# EAGLE design BatteryTestBoard V1 (EAGLE 8.2.2)
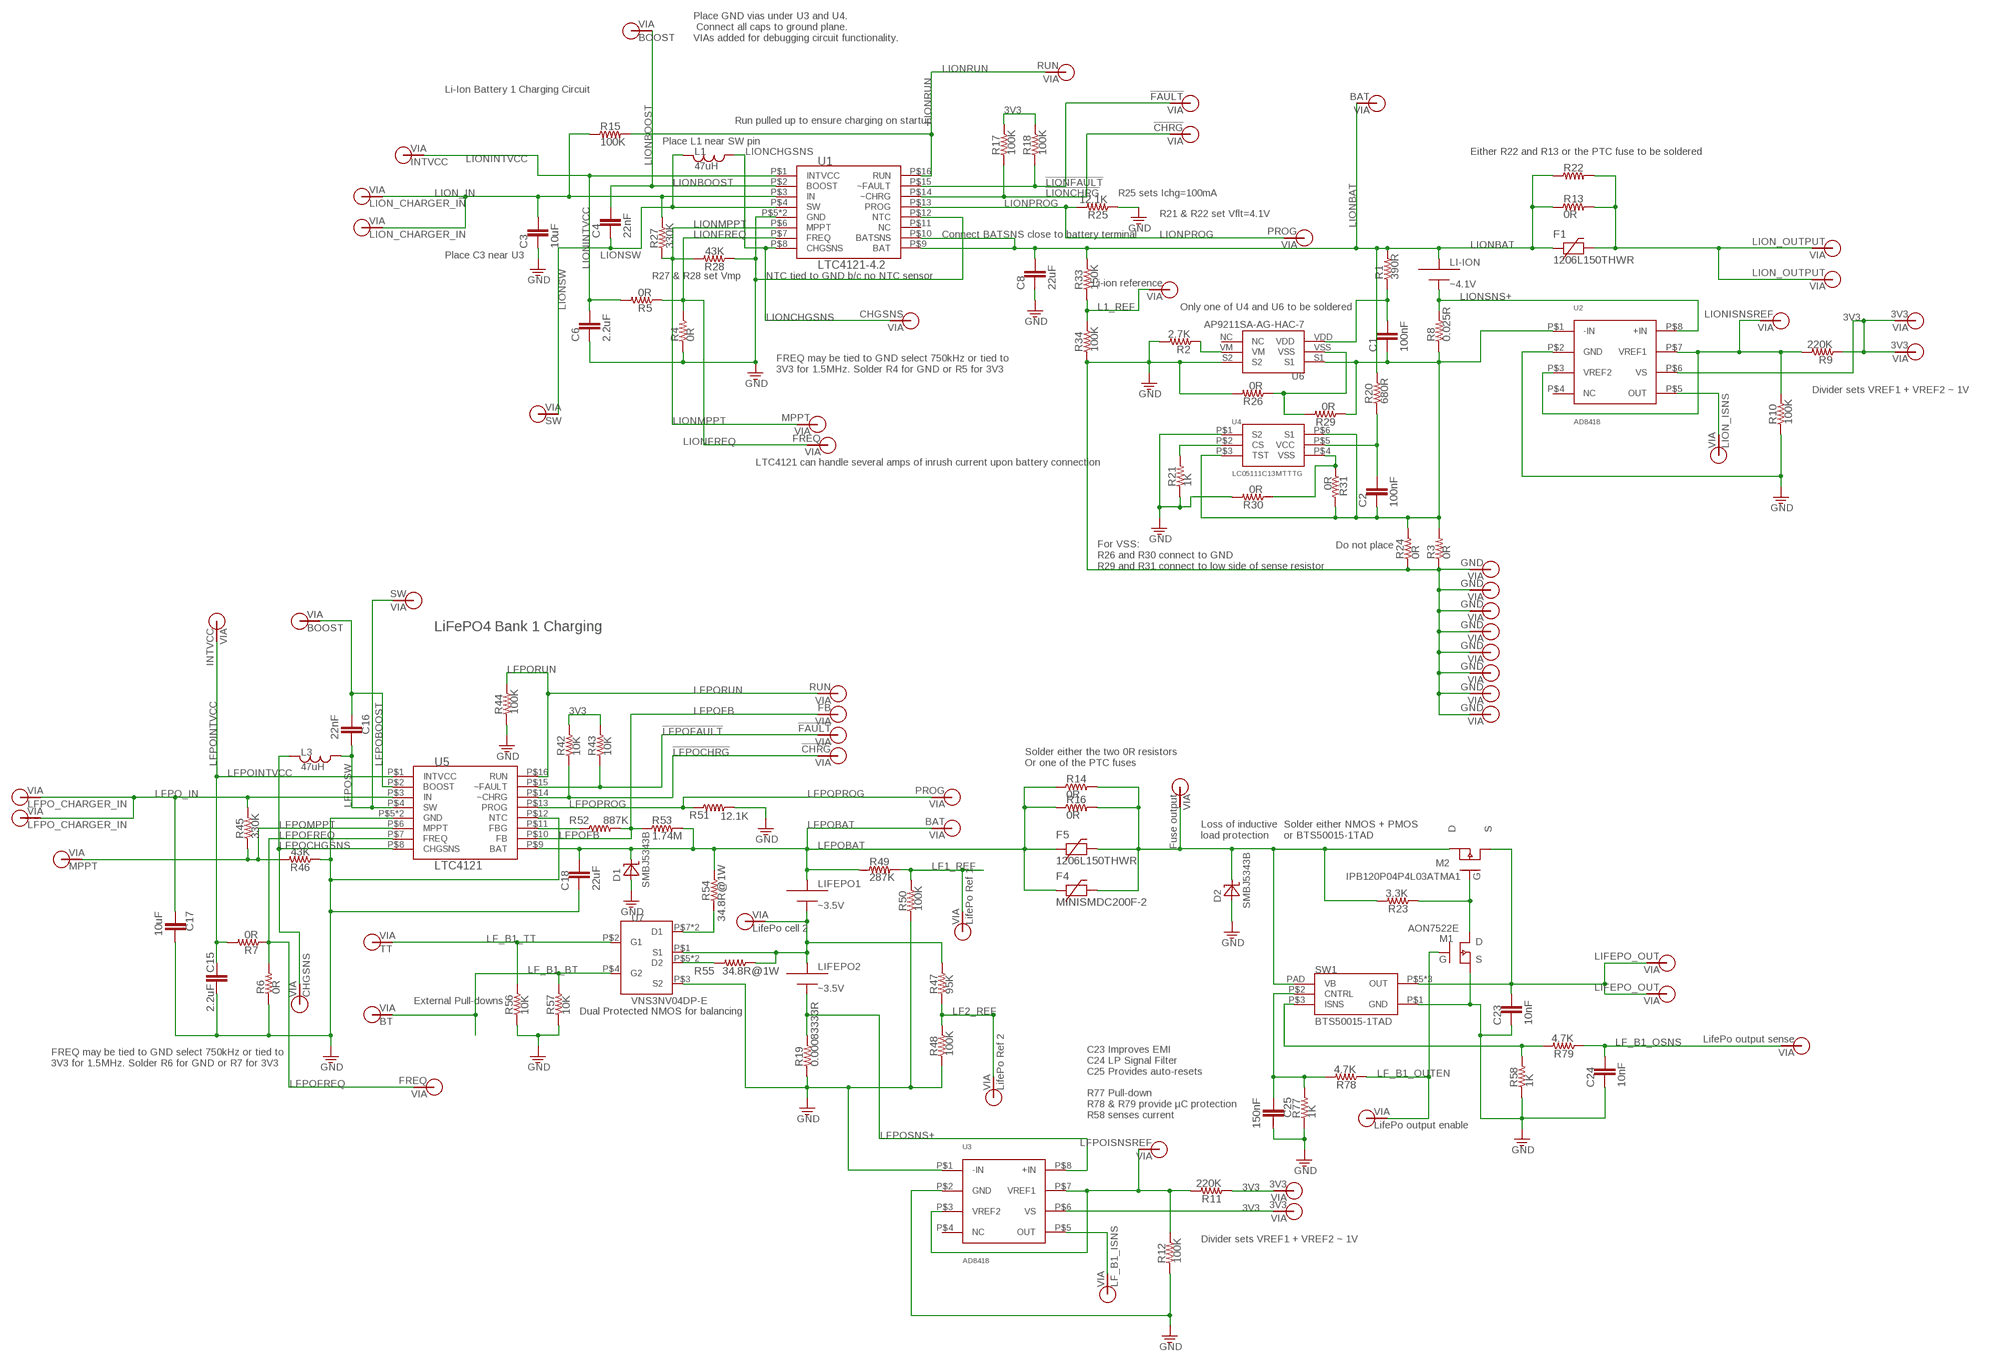
[diagram p0: schematic, sheet 1]

## Parts
C1  100nF  CAP0805  [0805]
C2  100nF  CAP0805  [0805]
C3  10uF  CAP0805  [0805]
C4  22nF  CAP0805  [0805]
C6  2.2uF  CAP0805  [0805]
C8  22uF  CAP0805  [0805]
C15  2.2uF  CAP0805  [0805]
C16  22nF  CAP0805  [0805]
C17  10uF  CAP0805  [0805]
C18  22uF  CAP0805  [0805]
C23  10nF  CAP0805  [0805]
C24  10nF  CAP0805  [0805]
C25  150nF  CAP0805  [0805]
D1  SMBJ5343B  [DO214AA]
D2  SMBJ5343B  [DO214AA]
F1  1206L150THWR  [1206]
F4  MINISMDC200F-2  [1812]
F5  1206L150THWR  [1206]
L1  47uH  IND1812  [1812]
L3  47uH  IND1812  [1812]
LI-ION  ~4.1V  LI-ION  [EQUISAT-BATTERY-VA]
LIFEPO1  ~3.5V  LIFEPO4VA  [EQUISAT-BATTERY-VA]
LIFEPO2  ~3.5V  LIFEPO4VA  [EQUISAT-BATTERY-VA]
M1  AON7522E  [DFN-3X3-8]
M2  IPB120P04P4L03ATMA1  [TO263]
R1  390R  RES0805  [0805]
R2  2.7K  RES0805  [0805]
R3  0R  RES1210  [1210]
R4  0R  RES0805  [0805]
R5  0R  RES0805  [0805]
R6  0R  RES0805  [0805]
R7  0R  RES0805  [0805]
R8  0.025R  RES1210  [1210]
R9  220K  RES0805  [0805]
R10  100K  RES0805  [0805]
R11  220K  RES0805  [0805]
R12  100K  RES0805  [0805]
R13  0R  RES1210  [1210]
R14  0R  RES1210  [1210]
R15  100K  RES0805  [0805]
R16  0R  RES1210  [1210]
R17  100K  RES0805  [0805]
R18  100K  RES0805  [0805]
R19  0.00083333R  RES1210  [1210]
R20  680R  RES0805  [0805]
R21  1K  RES0805  [0805]
R22  0R  RES1210  [1210]
R23  3.3K  RES0805  [0805]
R24  0R  RES1210  [1210]
R25  12.1K  RES0805  [0805]
R26  0R  RES0805  [0805]
R27  330K  RES0805  [0805]
R28  43K  RES0805  [0805]
R29  0R  RES0805  [0805]
R30  0R  RES0805  [0805]
R31  0R  RES0805  [0805]
R33  150K  RES0805  [0805]
R34  100K  RES0805  [0805]
R42  10K  RES0805  [0805]
R43  10K  RES0805  [0805]
R44  100K  RES0805  [0805]
R45  330K  RES0805  [0805]
R46  43K  RES0805  [0805]
R47  95K  RES0805  [0805]
R48  100K  RES0805  [0805]
R49  287K  RES0805  [0805]
R50  100K  RES0805  [0805]
R51  12.1K  RES0805  [0805]
R52  887K  RES0805  [0805]
R53  1.74M  RES0805  [0805]
R54  34.8R@1W  RES1210  [1210]
R55  34.8R@1W  RES1210  [1210]
R56  10K  RES0805  [0805]
R57  10K  RES0805  [0805]
R58  1K  RES0805  [0805]
R77  1K  RES0805  [0805]
R78  4.7K  RES0805  [0805]
R79  4.7K  RES0805  [0805]
SW1  BTS50015-1TAD  [TO-263-7-8]
U1  LTC4121-4.2  [QFN-16-PAD]
U2  AD8418  [MSOP-8]
U3  AD8418  [MSOP-8]
U4  LC05111C13MTTTG  [WDFN6]
U5  LTC4121  [QFN-16-PAD]
U6  AP9211SA-AG-HAC-7  [U-DFN2030-6]
U7  VNS3NV04DP-E  [SO-8]
V1  LION_OUTPUT  VIA-120MIL  [VIA-120MIL]
V2  Fuse output  VIA60MIL-SQ  [VIA-60MIL-SQ]
V3  GND  VIA60MIL-SQ  [VIA-60MIL-SQ]
V4  GND  VIA60MIL-SQ  [VIA-60MIL-SQ]
V5  GND  VIA60MIL-SQ  [VIA-60MIL-SQ]
V6  GND  VIA60MIL-SQ  [VIA-60MIL-SQ]
V7  GND  VIA60MIL-SQ  [VIA-60MIL-SQ]
V8  GND  VIA60MIL-SQ  [VIA-60MIL-SQ]
V9  LFPO_CHARGER_IN  VIA60MIL-SQ  [VIA-60MIL-SQ]
V10  GND  VIA60MIL-SQ  [VIA-60MIL-SQ]
V11  LFPOISNSREF  VIA60MIL-SQ  [VIA-60MIL-SQ]
V12  LIONISNSREF  VIA60MIL-SQ  [VIA-60MIL-SQ]
V13  LF_B1_ISNS  VIA60MIL-SQ  [VIA-60MIL-SQ]
V16  LifePo cell 2  VIA60MIL-SQ  [VIA-60MIL-SQ]
V20  LifePo output enable  VIA60MIL-SQ  [VIA-60MIL-SQ]
V21  LIFEPO_OUT  VIA-120MIL  [VIA-120MIL]
V26  LIFEPO_OUT  VIA-120MIL  [VIA-120MIL]
V29  TT  VIA60MIL-SQ  [VIA-60MIL-SQ]
V31  LifePo output sense  VIA60MIL-SQ  [VIA-60MIL-SQ]
V32  BT  VIA60MIL-SQ  [VIA-60MIL-SQ]
V34  LION_CHARGER_IN  VIA60MIL-SQ  [VIA-60MIL-SQ]
V35  LION_CHARGER_IN  VIA60MIL-SQ  [VIA-60MIL-SQ]
V36  BOOST  VIA60MIL-SQ  [VIA-60MIL-SQ]
V37  LION_OUTPUT  VIA-120MIL  [VIA-120MIL]
V38  SW  VIA60MIL-SQ  [VIA-60MIL-SQ]
V39  MPPT  VIA60MIL-SQ  [VIA-60MIL-SQ]
V41  GND  VIA60MIL-SQ  [VIA-60MIL-SQ]
V43  LION_ISNS  VIA60MIL-SQ  [VIA-60MIL-SQ]
V44  Li-ion reference  VIA60MIL-SQ  [VIA-60MIL-SQ]
V46  CHGSNS  VIA60MIL-SQ  [VIA-60MIL-SQ]
V47  FREQ  VIA60MIL-SQ  [VIA-60MIL-SQ]
V48  BAT  VIA60MIL-SQ  [VIA-60MIL-SQ]
V50  PROG  VIA60MIL-SQ  [VIA-60MIL-SQ]
V51  !CHRG  VIA60MIL-SQ  [VIA-60MIL-SQ]
V52  !FAULT  VIA60MIL-SQ  [VIA-60MIL-SQ]
V53  RUN  VIA60MIL-SQ  [VIA-60MIL-SQ]
V54  BOOST  VIA60MIL-SQ  [VIA-60MIL-SQ]
V55  INTVCC  VIA60MIL-SQ  [VIA-60MIL-SQ]
V57  SW  VIA60MIL-SQ  [VIA-60MIL-SQ]
V58  LifePo Ref 1  VIA60MIL-SQ  [VIA-60MIL-SQ]
V59  LifePo Ref 2  VIA60MIL-SQ  [VIA-60MIL-SQ]
V60  MPPT  VIA60MIL-SQ  [VIA-60MIL-SQ]
V61  CHGSNS  VIA60MIL-SQ  [VIA-60MIL-SQ]
V62  FREQ  VIA60MIL-SQ  [VIA-60MIL-SQ]
V63  BAT  VIA60MIL-SQ  [VIA-60MIL-SQ]
V65  PROG  VIA60MIL-SQ  [VIA-60MIL-SQ]
V66  !CHRG  VIA60MIL-SQ  [VIA-60MIL-SQ]
V67  !FAULT  VIA60MIL-SQ  [VIA-60MIL-SQ]
V68  RUN  VIA60MIL-SQ  [VIA-60MIL-SQ]
V69  INTVCC  VIA60MIL-SQ  [VIA-60MIL-SQ]
V70  FB  VIA60MIL-SQ  [VIA-60MIL-SQ]
V71  3V3  VIA60MIL-SQ  [VIA-60MIL-SQ]
V72  3V3  VIA60MIL-SQ  [VIA-60MIL-SQ]
V73  3V3  VIA60MIL-SQ  [VIA-60MIL-SQ]
V74  3V3  VIA60MIL-SQ  [VIA-60MIL-SQ]
V75  LFPO_CHARGER_IN  VIA60MIL-SQ  [VIA-60MIL-SQ]

## Nets
3V3: R9.1 R11.1 R17.2 R18.2 R42.2 R43.2 U2.P$6(VS) U3.P$6(VS) V71.P$1 V72.P$1 V73.P$1 V74.P$1
!LFPOCHRG: R42.1 U5.P$14(~CHRG) V66.P$1
!LFPOFAULT: R43.1 U5.P$15(~FAULT) V67.P$1
!LIONCHRG: R17.1 U1.P$14(~CHRG) V51.P$1
!LIONFAULT: R18.1 U1.P$15(~FAULT) V52.P$1
FUSE_OUT: D2.C F4.P$2 F5.2 M2.2(D) R14.P$2 R16.P$2 R23.2 SW1.PAD(VB) V2.P$1
GND: C3.2 C6.2 C8.2 C15.1 C17.1 C18.2 C23.2 C24.2 C25.1 D1.A D2.A M1.P$1(S) M1.P$2(S) M1.P$3(S) R2.2 R3.P$1 R4.1 R6.1 R10.1 R12.1 R19.P$1 R21.1 R24.P$1 R25.1 R26.2 R28.1 R30.2 R34.1 R44.1 R46.1 R48.1 R50.1 R51.2 R56.1 R57.1 R58.1 R77.1 SW1.P$1(GND) U1.P$5(GND) U1.P$12(NTC) U1.P$17(GND) U2.P$2(GND) U3.P$1(-IN) U3.P$2(GND) U4.P$1(S2) U5.P$5(GND) U5.P$12(NTC) U5.P$17(GND) U6.S2 U7.P$3(S2) V3.P$1 V4.P$1 V5.P$1 V6.P$1 V7.P$1 V8.P$1 V10.P$1 V41.P$1
L1_REF: R33.1 R34.2 V44.P$1
L1_SNS: U2.P$5(OUT) V43.P$1
L1_SNS1: U3.P$5(OUT) V13.P$1
LF1_REF: R49.2 R50.2 V58.P$1
LF2_REF: R47.1 R48.2 V59.P$1
LF_B1_BT: R57.2 U7.P$4(G2) V32.P$1
LF_B1_OSNS: C24.1 R79.1 V31.P$1
LF_B1_OUTEN: M1.P$4(G) R78.1 V20.P$1
LF_B1_TT: R56.2 U7.P$2(G1) V29.P$1
LFPO_IN: C17.2 R45.2 U5.P$3(IN) V9.P$1 V75.P$1
LFPOBAT: C18.1 D1.C F4.P$1 F5.1 LIFEPO1.PLUS R14.P$1 R16.P$1 R49.1 R53.2 R54.P$2 U5.P$9(BAT) V63.P$1
LFPOBOOST: C16.2 U5.P$2(BOOST) V54.P$1
LFPOCHGSNS: L3.P$1 U5.P$8(CHGSNS) V61.P$1
LFPOFB: R52.2 R53.1 U5.P$10(FB) V70.P$1
LFPOFREQ: R6.2 R7.1 U5.P$7(FREQ) V62.P$1
LFPOINTVCC: C15.2 R7.2 U5.P$1(INTVCC) V69.P$1
LFPOMPPT: R45.1 R46.2 U5.P$6(MPPT) V60.P$1
LFPOPROG: R51.1 U5.P$13(PROG) V65.P$1
LFPORUN: R44.2 U5.P$16(RUN) V68.P$1
LFPOSNS+: LIFEPO2.MINUS R19.P$2 U3.P$8(+IN)
LFPOSW: C16.1 L3.P$2 U5.P$4(SW) V57.P$1
LIFE2: LIFEPO1.MINUS LIFEPO2.PLUS R47.2 R55.P$1 U7.P$1(S1) V16.P$1
LION_IN: C3.1 R15.1 R27.2 U1.P$3(IN) V34.P$1 V35.P$1
LIONBAT: C8.1 F1.1 LI-ION.PLUS R1.2 R13.P$1 R20.2 R22.P$1 R33.2 U1.P$9(BAT) U1.P$10(BATSNS) V48.P$1
LIONBOOST: C4.1 U1.P$2(BOOST) V36.P$1
LIONCHGSNS: L1.P$2 U1.P$8(CHGSNS) V46.P$1
LIONFREQ: R4.2 R5.1 U1.P$7(FREQ) V47.P$1
LIONINTVCC: C6.1 R5.2 U1.P$1(INTVCC) V55.P$1
LIONMPPT: R27.1 R28.2 U1.P$6(MPPT) V39.P$1
LIONPROG: R25.2 U1.P$13(PROG) V50.P$1
LIONRUN: R15.2 U1.P$16(RUN) V53.P$1
LIONSNS+: LI-ION.MINUS R8.P$2 U2.P$8(+IN)
LIONSW: C4.2 L1.P$1 U1.P$4(SW) V38.P$1
LPFOFBG: R52.1 U5.P$11(FBG)
N$1: R2.1 U6.VM
N$2: R11.2 R12.2 U3.P$3(VREF2) U3.P$7(VREF1) V11.P$1
N$3: F1.2 R13.P$2 R22.P$2 V1.P$1 V37.P$1
N$4: R26.1 R29.2 U6.VSS
N$5: C1.1 R1.1 U6.VDD
N$6: C23.1 M2.3(S) SW1.P$5(OUT) SW1.P$6(OUT) SW1.P$7(OUT) V21.P$1 V26.P$1
N$7: M1.P$5(D) M1.P$6(D) M1.P$7(D) M1.P$8(D) M1.PAD(D) M2.1(G) R23.1
N$8: C2.1 R20.1 U4.P$5(VCC)
N$9: C1.2 C2.2 R3.P$2 R8.P$1 R24.P$2 R29.1 R31.2 U2.P$1(-IN) U4.P$3(TST) U4.P$6(S1) U6.S1
N$10: R30.1 R31.1 U4.P$4(VSS)
N$11: R9.2 R10.2 U2.P$3(VREF2) U2.P$7(VREF1) V12.P$1
N$14: R21.2 U4.P$2(CS)
N$24: R54.P$1 U7.P$7(D1) U7.P$8(D1)
N$25: R55.P$2 U7.P$5(D2) U7.P$6(D2)
N$68: C25.2 R77.2 R78.2 SW1.P$2(CNTRL)
N$686: R58.2 R79.2 SW1.P$3(ISNS)
Unconnected: U1.P$11(NC) U2.P$4(NC) U3.P$4(NC) U6.NC

## Notes on the sheet
- Place GND vias under U3 and U4.
   Connect all caps to ground plane.
  VIAs added for debugging circuit functionality.
- Li-Ion Battery 1 Charging Circuit
- Run pulled up to ensure charging on startup
- Place L1 near SW pin
- Either R22 and R13 or the PTC fuse to be soldered
- R25 sets Ichg=100mA
- R21 & R22 set Vflt=4.1V
- Connect BATSNS close to battery terminal
- Place C3 near U3
- R27 & R28 set Vmp | NTC tied to GND b/c no NTC sensor
- Only one of U4 and U6 to be soldered
- FREQ may be tied to GND select 750kHz or tied to 
  3V3 for 1.5MHz. Solder R4 for GND or R5 for 3V3
- Divider sets VREF1 + VREF2 ~ 1V
- LTC4121 can handle several amps of inrush current upon battery connection
- Do not place
- For VSS:
  R26 and R30 connect to GND
  R29 and R31 connect to low side of sense resistor
- LiFePO4 Bank 1 Charging
- Solder either the two 0R resistors
  Or one of the PTC fuses
- Loss of inductive
  load protection
- Solder either NMOS + PMOS
  or BTS50015-1TAD
- AON7522E
- External Pull-downs
- Dual Protected NMOS for balancing
- FREQ may be tied to GND select 750kHz or tied to 
  3V3 for 1.5MHz. Solder R6 for GND or R7 for 3V3
- C23 Improves EMI
  C24 LP Signal Filter
  C25 Provides auto-resets
  
  R77 Pull-down
  R78 & R79 provide µC protection
  R58 senses current
- Divider sets VREF1 + VREF2 ~ 1V

## Library data of the parts
C1-C4 C6 C8 C15-C18 C23-C25 = BrownSpaceEngineering:CAP: Capacitor
D1 D2 = BattBoard:SMBJ5343B
F1 F5 = BattBoard:1206L150THWR
F4 = BattBoard:MINISMDC200F-2
L1 L3 = BrownSpaceEngineering:IND
LI-ION = BrownSpaceEngineering:LI-ION
LIFEPO1 LIFEPO2 = BrownSpaceEngineering:LIFEPO4
M1 = BrownSpaceEngineering:AON7522E
M2 = BattBoard:IPB120P04P4L03ATMA1
R1-R31 R33 R34 R42-R58 R77-R79 = BrownSpaceEngineering:RES
SW1 = BrownSpaceEngineering:BTS50015-1TAD
U1 = BrownSpaceEngineering:LTC4121-4.2
U2 U3 = BattBoard:AD8418
U4 = BattBoard:LC05111C13MTTTG
U5 = BrownSpaceEngineering:LTC4121
U6 = BattBoard:AP9211SA-AG-HAC-7
U7 = BrownSpaceEngineering:VNS3NV04DP-E
V1-V13 V16 V20 V21 V26 V29 V31 V32 V34-V39 V41 V43 V44 V46-V48 V50-V55 V57-V63 V65-V75 = BrownSpaceEngineering:VIA

## Net classes
0 default: width 0.203 mm

## Board
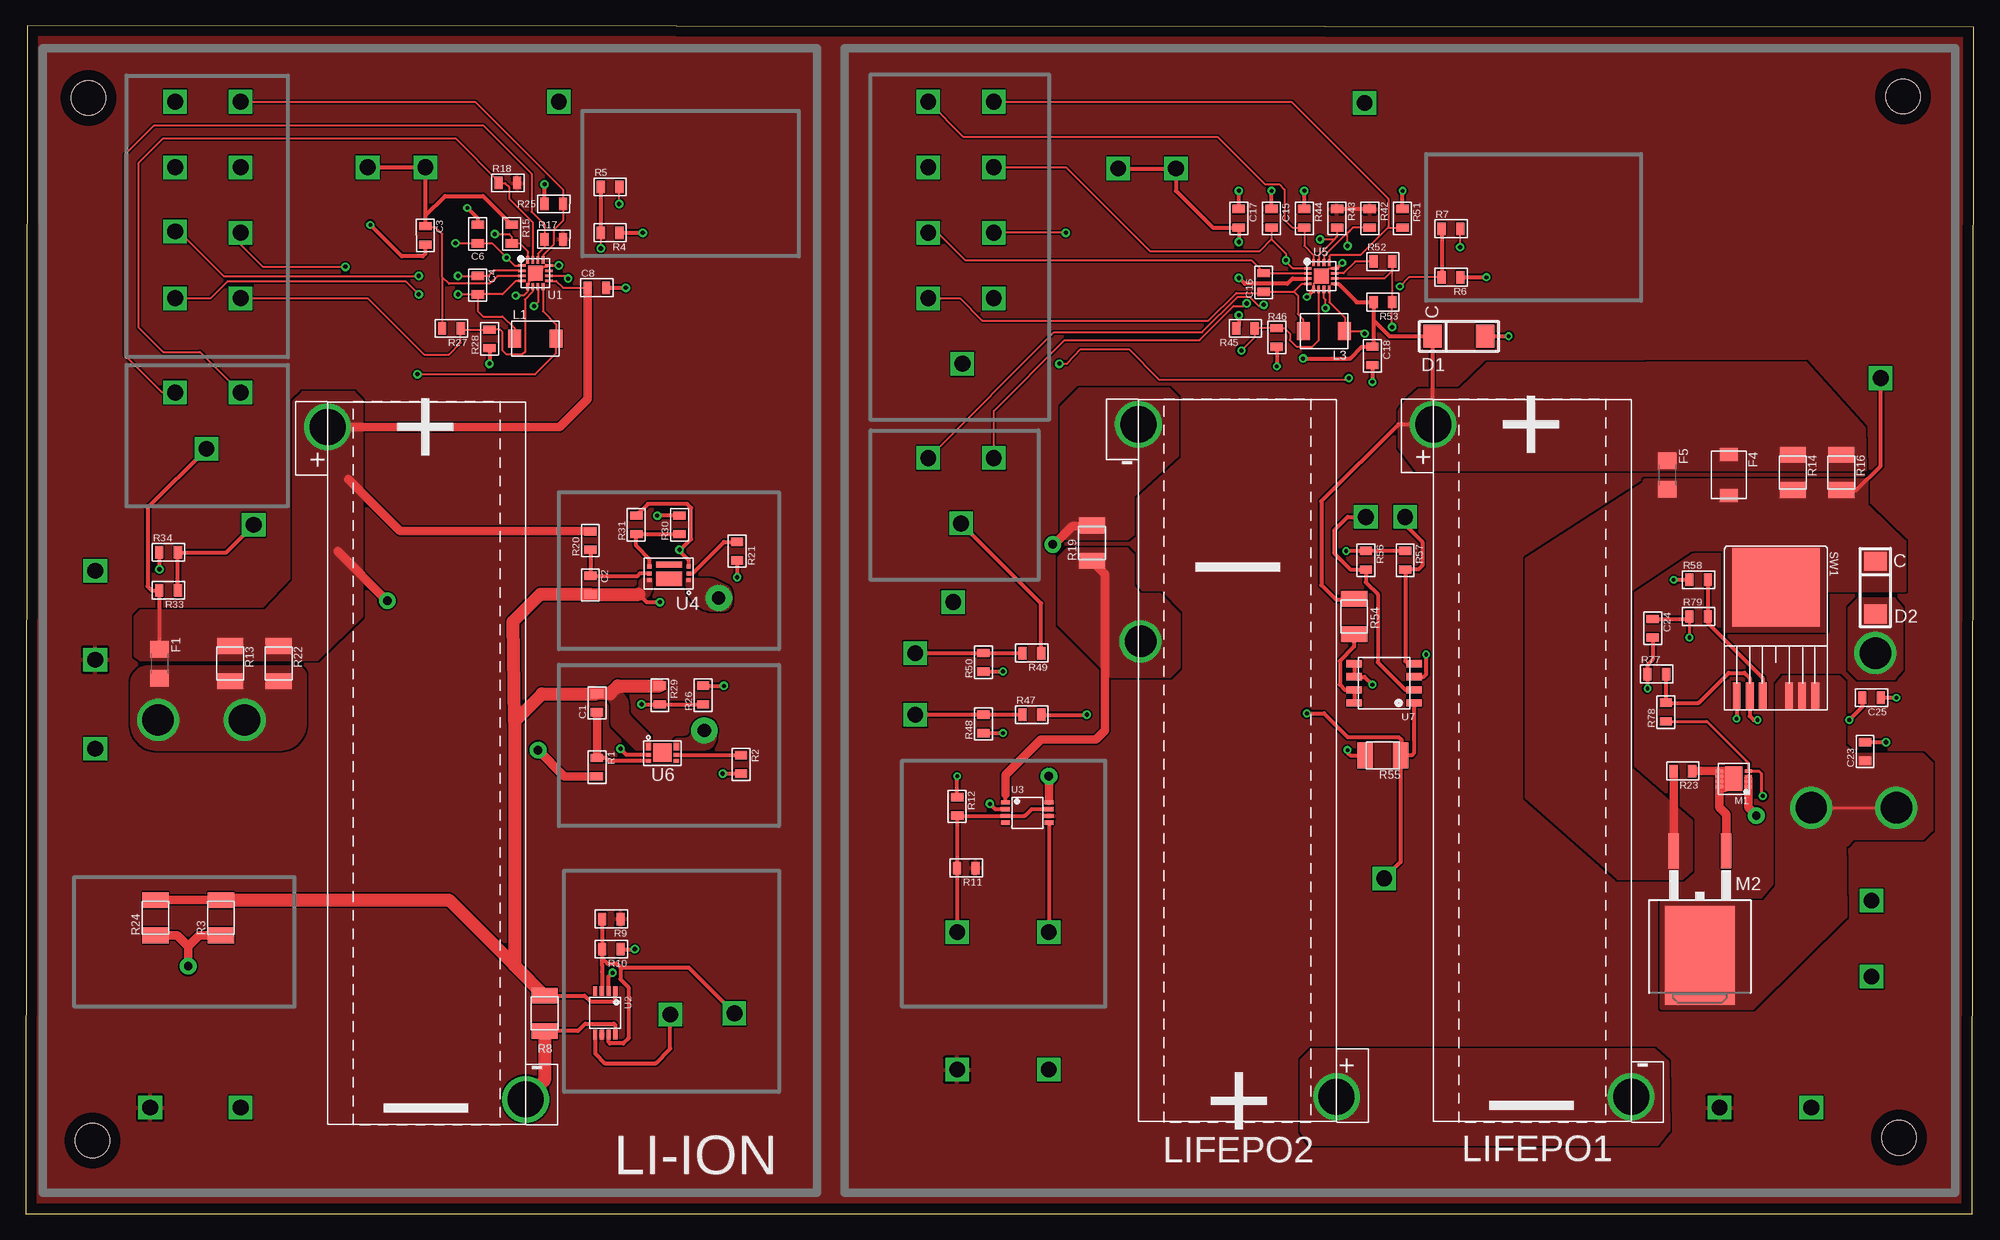
[diagram p1: board, top side]
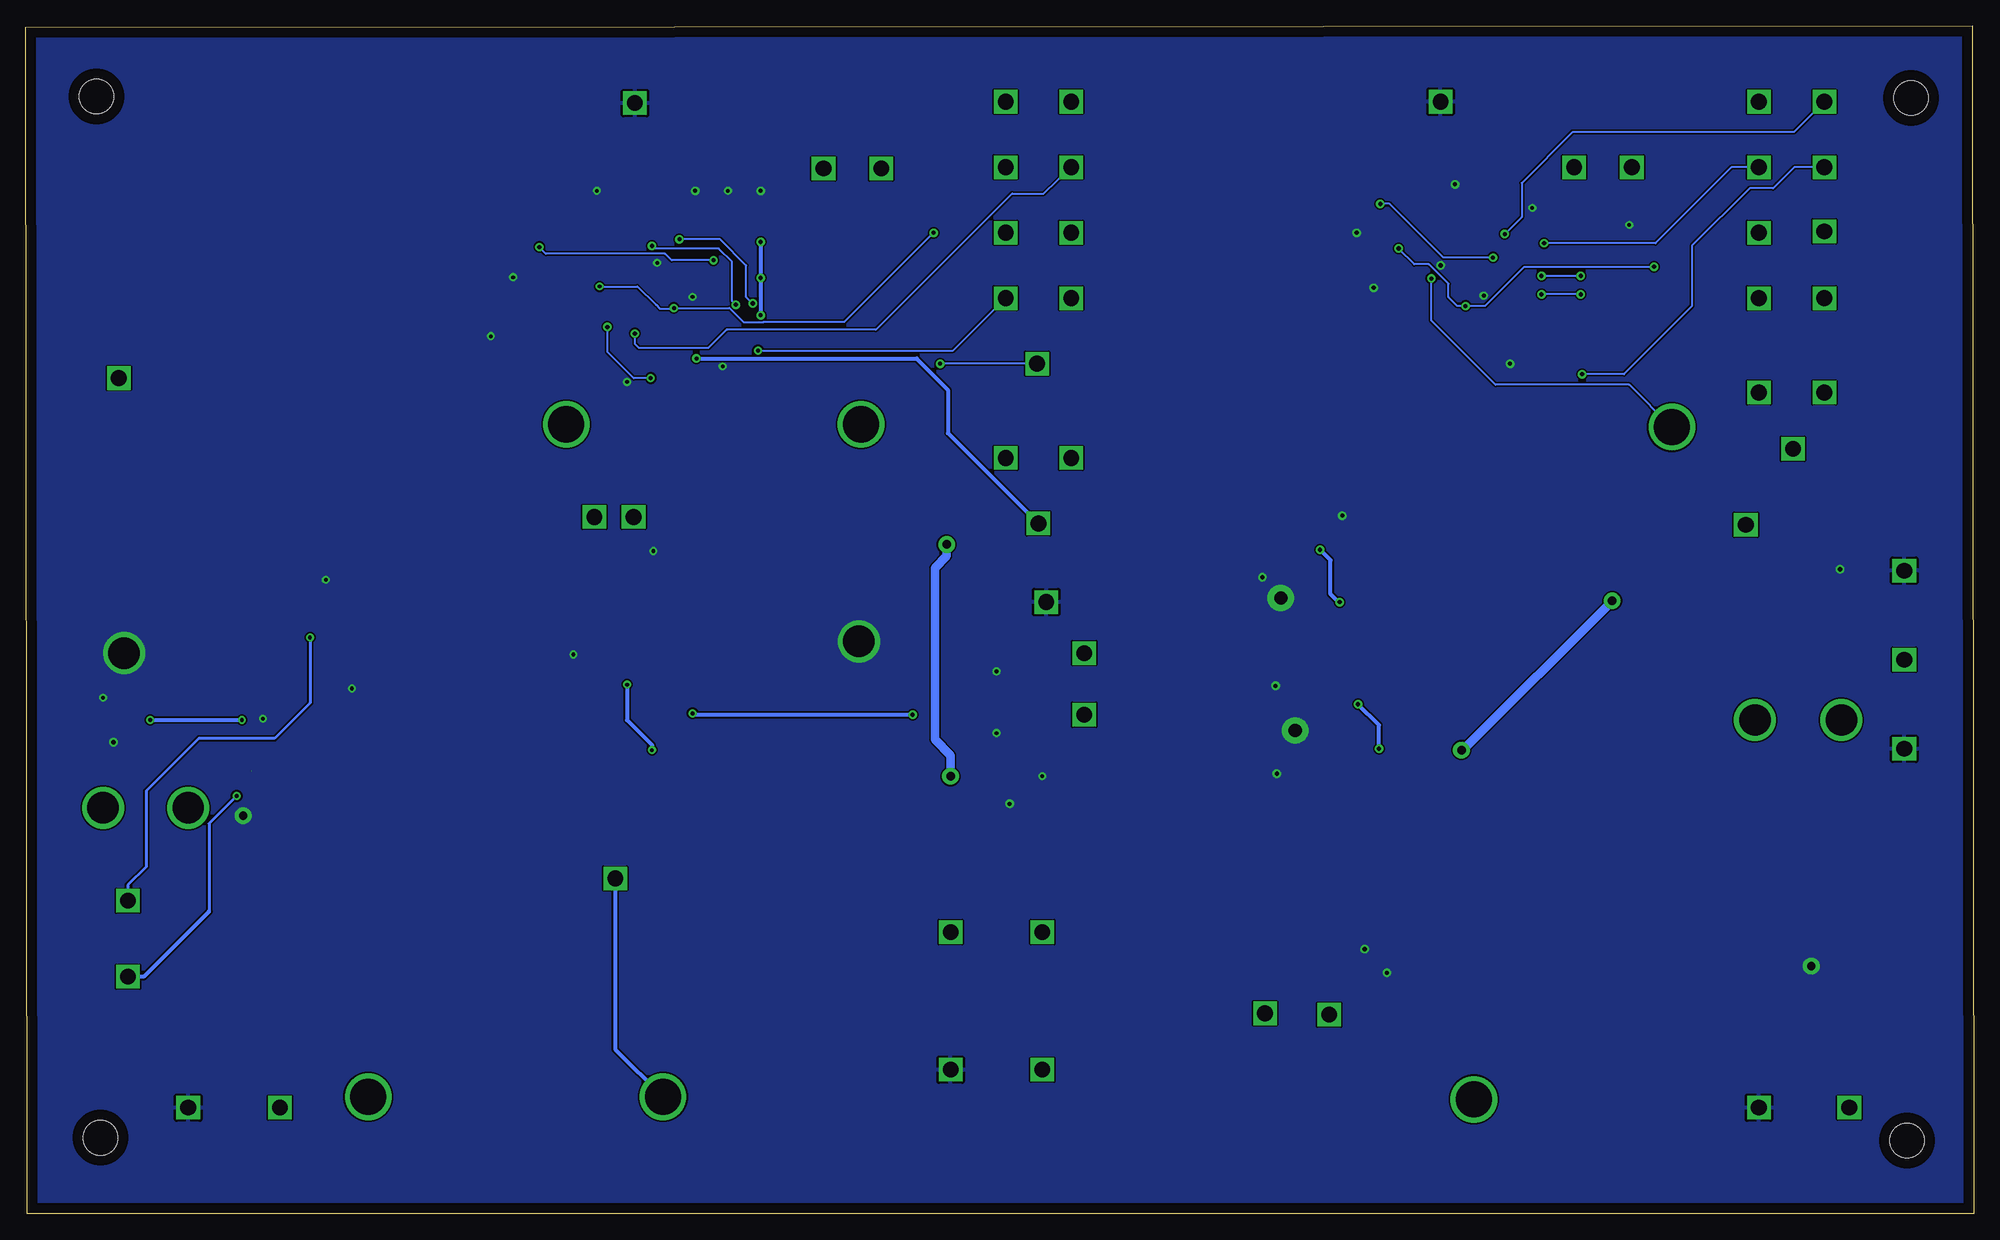
[diagram p2: board, bottom side, seen from below]

Size 188.85 x 115.19 mm. Coordinates in mm from the lower left corner, seen from the top.
Outline: 0,0 188.72,0 188.85,115.06 0.13,115.19 0,0
Copper layers (1*16): Top 0.035mm / dielectric 1.4mm / Bottom 0.035mm
Design rules "default *": minimum track width 6mil, minimum drill 0.35mm, track to track 6mil, track to pad 6mil, pad to pad 6mil, via to via 6mil, smd to smd 6mil, copper to edge 40mil, drill to drill 6mil, minimum pad ring 10mil, minimum via ring 8mil, stop-mask expansion 4mil, vias tented up to drill 0mil, thermal gap 10mil
Holes 3.35 mm at 6.1,108.2 6.48,7.11 181.61,7.37 181.99,108.33

### Footprints (pad centres in the part's own frame; a part is rotated, then mirrored left to right if it is on the bottom)
0805 = smd 0.8 x 1.2: 1 -0.9,0; 2 0.9,0
DO214AA = smd 1.8 x 2.2: A 2.55,0; C -2.55,0
1206 = smd 1.6 x 1.8: 1 -1.4,0; 2 1.4,0
1812 = smd 1.25 x 1.75: P$1 -2,0; P$2 2,0
EQUISAT-BATTERY-VA = drill 3.5: MINUS 9.6,-32.6; PLUS -9.6,32.6
DFN-3X3-8 = smd 0.3 x 0.7: P$1 -0.75,-1.25; P$2 -0.25,-1.25; P$3 0.25,-1.25; P$4 0.75,-1.25; P$5 0.75,1.55; P$6 0.25,1.55; P$7 -0.25,1.55; P$8 -0.75,1.55 | smd 2.38 x 1.65: PAD 0,0.15
TO263 = smd 1 x 3.4: 1 -2.54,-6.6; 2 2.54,-6.6 | smd 6.8 x 9.6: 3 0,3.5
1210 = smd 1.52 x 2.54: P$1 -1.71,0 | smd 1.51 x 2.54: P$2 1.71,0
TO-263-7-8 = smd 0.75 x 2.6: P$1 0,0.7; P$2 1.27,0.7; P$3 2.54,0.7; P$5 5.08,0.7; P$6 6.35,0.7; P$7 7.62,0.7 | smd 8.5 x 7.6: PAD 3.81,11.2
QFN-16-PAD = smd 0.7 x 0.25: P$1 -1.3,0.75; P$2 -1.3,0.25; P$3 -1.3,-0.25; P$4 -1.3,-0.75; P$9 1.3,-0.75; P$10 1.3,-0.25; P$11 1.3,0.25; P$12 1.3,0.75 | smd 0.25 x 0.7: P$5 -0.75,-1.3; P$6 -0.25,-1.3; P$7 0.25,-1.3; P$8 0.75,-1.3; P$13 0.75,1.3; P$14 0.25,1.3; P$15 -0.25,1.3; P$16 -0.75,1.3 | smd 1.45 x 1.45: P$17 0,0
MSOP-8 = smd 0.42 x 0.89: P$1 0,0; P$2 0.65,0; P$3 1.3,0; P$4 1.95,0; P$5 1.95,4.21; P$6 1.3,4.21; P$7 0.65,4.21; P$8 0,4.21
WDFN6 = smd 0.4 x 0.4: P$1 -0.66,-1.89; P$2 -0.01,-1.89; P$3 0.64,-1.89; P$4 0.64,1.91; P$5 -0.01,1.91; P$6 -0.66,1.91 | smd 1.42 x 2.5: PAD1 -0.54,0 | smd 0.62 x 2.5: PAD2 0.85,0
U-DFN2030-6 = smd 0.4 x 0.5: NC 0.8,1.35; VDD 0.8,-1.35; VM 0.2,1.35; VSS 0.2,-1.35 | smd 1.8 x 1.8: P$7 0,0 | smd 0.75 x 0.5: S1 -0.57,-1.35; S2 -0.57,1.35
SO-8 = smd 0.7 x 1.5: P$1 -1.905,-2.9; P$2 -0.635,-2.9; P$3 0.635,-2.9; P$4 1.905,-2.9; P$5 1.905,2.9; P$6 0.635,2.9; P$7 -0.635,2.9; P$8 -1.905,2.9
VIA-120MIL = drill 3.048: P$1 0,0
VIA-60MIL-SQ = drill 1.524 square: P$1 0,0

### Placement (x,y rotation side)
C1  55.37,49.53 90 top
C2  54.74,60.96 270 top
C3  38.73,94.87 270 top
C4  43.81,90.04 270 top
C6  43.81,95 90 top
C8  55.37,89.79 0 top
C15  120.78,96.52 270 top
C16  120.02,90.3 90 top
C17  117.6,96.52 270 top
C18  130.56,83.19 270 top
C23  178.31,44.83 90 top
C24  157.73,56.77 270 top
C25  178.94,50.04 180 top
D1  138.94,85.09 0 top
D2  179.32,60.71 270 top
F1  12.95,53.34 270 top
F4  165.1,71.63 270 top
F5  159.13,71.63 270 top
L1  49.4,84.84 0 top
L3  125.86,85.6 180 top
LI-ION  38.86,43.69 0 top
LIFEPO1  146.05,43.94 0 top
LIFEPO2  117.47,43.94 180 top
M1  165.74,42.16 90 top
M2  162.31,28.57 180 top
R1  55.37,43.31 270 top
R2  69.34,43.56 270 top
R3  18.92,28.7 90 top
R4  56.64,95.12 180 top
R5  56.64,99.57 0 top
R6  138.18,90.81 180 top
R7  138.18,95.5 0 top
R8  50.29,19.43 270 top
R9  56.77,28.57 180 top
R10  56.77,25.65 180 top
R11  91.19,33.53 180 top
R12  90.3,39.5 270 top
R13  19.81,53.34 270 top
R14  171.32,71.88 270 top
R15  47.12,95 270 top
R16  176.02,71.88 270 top
R17  51.18,94.49 0 top
R18  46.74,99.95 0 top
R19  103.38,65.02 90 top
R20  54.74,65.28 90 top
R21  68.96,64.26 90 top
R22  24.51,53.34 270 top
R23  160.66,42.93 180 top
R24  12.57,28.7 90 top
R25  51.18,97.92 0 top
R26  65.66,50.29 90 top
R27  41.27,85.85 180 top
R28  44.96,84.84 90 top
R29  61.47,50.29 270 top
R30  63.37,66.8 90 top
R31  59.18,66.8 90 top
R33  13.84,60.45 180 top
R34  13.84,64.14 0 top
R42  130.3,96.52 90 top
R43  127.13,96.52 90 top
R44  123.95,96.52 270 top
R45  118.24,85.85 180 top
R46  121.28,84.96 90 top
R47  97.54,48.39 0 top
R48  92.84,47.5 90 top
R49  97.54,54.36 180 top
R50  92.84,53.47 90 top
R51  133.48,96.52 90 top
R52  131.57,92.33 0 top
R53  131.57,88.39 180 top
R54  128.78,57.91 90 top
R55  131.57,44.45 180 top
R56  129.92,63.37 270 top
R57  133.73,63.37 270 top
R58  162.18,61.47 0 top
R77  158.12,52.32 0 top
R78  159,48.64 90 top
R79  162.18,57.91 0 top
SW1  165.86,49.53 0 top
U1  49.4,91.19 0 top
U2  57.15,21.59 180 top
U3  95,39.88 270 top
U4  62.36,62.1 90 top
U5  125.6,90.93 0 top
U6  61.72,44.7 270 top
U7  131.7,51.44 90 top
V1  21.21,47.88 0 top
V2  179.83,81.03 0 top
V3  6.73,45.09 0 top
V4  51.69,107.82 0 top
V5  89.92,59.31 0 top
V6  129.79,107.7 0 top
V7  6.73,62.36 0 top
V8  20.83,10.29 0 top
V9  111.51,101.35 0 top
V10  173.1,10.29 0 top
V11  90.3,27.3 0 top
V12  68.71,19.43 0 top
V13  99.19,27.3 0 top
V16  Cell 2  [VIA-60MIL-SQ]  131.7,32.51 0 top
V20  178.94,22.99 0 top
V21  173.1,39.37 0 top
V26  181.36,39.37 0 top
V29  129.92,67.56 0 top
V31  178.94,30.35 0 top
V32  133.73,67.56 0 top
V34  38.73,101.47 0 top
V35  33.15,101.47 0 top
V36  14.48,95.25 0 top
V37  12.83,47.88 0 top
V38  14.48,88.77 0 top
V39  20.83,88.77 0 top
V41  99.19,13.97 0 top
V43  62.48,19.3 0 top
V44  22.1,66.8 0 top
V46  14.48,101.47 0 top
V47  20.83,95.12 0 top
V48  17.53,74.17 0 top
V50  20.83,107.82 0 top
V51  14.48,79.63 0 top
V52  20.83,79.63 0 top
V53  14.48,107.82 0 top
V54  87.5,95.12 0 top
V55  20.83,101.47 0 top
V57  87.5,88.77 0 top
V58  86.23,54.36 0 top
V59  86.23,48.39 0 top
V60  93.85,88.77 0 top
V61  87.5,101.47 0 top
V62  93.85,95.12 0 top
V63  90.68,66.93 0 top
V65  93.85,107.82 0 top
V66  87.5,73.28 0 top
V67  93.85,73.28 0 top
V68  87.5,107.82 0 top
V69  93.85,101.47 0 top
V70  90.81,82.42 0 top
V71  6.73,53.72 0 top
V72  90.3,13.97 0 top
V73  164.21,10.29 0 top
V74  12.06,10.29 0 top
V75  105.92,101.35 0 top

### Tracks (layer width: path | path; a pad name or v marks a point on that pad's centre or on a via)
3V3
  Top 0.406: R42.2 R43.2
  pour Top (rank 2): 0.13,115.06 188.85,115.06 188.72,0 0,0
!LFPOCHRG  (via drill 0.41 pad 0.81)
  Top 0.203: U5.P$14 125.86,92.84 128.14,95.12 | R42.1 128.64,95.62 128.35,95.33 128.14,95.12 | V66.P$1 99.69,85.47 114.05,85.47 117.5,88.92 118.64,88.92 119.55,88.01 119.89,88.01 v120.02,88.14 | v128.14,93.85 128.14,95.12
  Bottom 0.203: v120.02,88.14 120.4,88.52 120.4,92.33 121.67,93.6 127.89,93.6 v128.14,93.85
!LFPOFAULT  (via drill 0.41 pad 0.81)
  Top 0.203: R43.1 127.13,94.74 126.85,94.46 | U5.P$15 125.35,92.96 126.85,94.46 | V67.P$1 93.85,77.85 100.71,84.71 113.79,84.71 117.09,88.01 118.11,88.01 v118.36,88.27 | v125.48,94.49 126.82,94.49 126.85,94.46
  Bottom 0.203: v118.36,88.27 119,88.9 119,91.95 121.54,94.49 v125.48,94.49
!LIONCHRG
  Top 0.203: U1.P$14 49.66,93.09 50.28,93.72 R17.1 50.29,94.5 50.29,95.89 49.02,97.16 49.02,100.84 44.32,105.54 12.45,105.54 9.65,102.74 9.65,83.19 13.21,79.63 V51.P$1
!LIONFAULT
  Top 0.203: 45.99,99.95 R18.1 | 45.99,99.95 46.48,99.95 46.86,99.57 46.86,98.42 49.15,96.14 U1.P$15 | 45.99,99.95 41.67,104.27 13.34,104.27 10.92,101.85 10.92,85.98 13.34,83.57 16.89,83.57 V52.P$1
FUSE_OUT
  Top 0.406: R16.P$2 177.49,70.17 179.83,72.52 V2.P$1
  Top 0.813: R23.2 159.75,36.33 M2.2
  pour Top (no thermals): 156.97,71.12 178.44,71.12 178.44,68.58 174.5,64.52 174.5,56.52 164.72,56.52 164.72,64.52 156.97,68.58
  pour Top (no thermals): 178.56,68.58 182.12,65.15 182.12,60.45 172.72,60.45 172.85,67.69
  pour Top (no thermals): 164.97,64.39 161.54,64.39 155.57,60.45 155.57,43.18 161.42,38.1 161.42,33.27 160.53,32.51 154.43,32.51 145.54,40.39 145.54,63.5 156.97,70.87 164.97,65.02
GND  (via drill 0.35, 0.41 pad 0.81, 0.81 pad 1.63, 1.27 pad 2.54, 3.05)
  Top 0.203: 48.64,89.87 U1.P$5 48.65,89.42 48.26,89.03 v47.5,89.03 | U5.P$5 124.85,89.9 124.91,89.95 124.91,90.24 U5.P$17 126.3,91.63 126.58,91.63 126.64,91.68 U5.P$12
  Top 0.254: U1.P$5 48.65,90.06 48.75,90.15 48.75,90.35 48.91,90.52 49.11,90.52 49.15,90.55 49.15,90.93 U1.P$17 49.66,91.44 50.07,91.44 50.07,91.68 50.24,91.84 50.56,91.84 50.66,91.94 U1.P$12 51.68,91.94 v51.69,91.95
  Top 0.305: 166.99,42.2 M1.P$3 M1.P$2
  Top 0.406: R25.1 v50.28,99.81 v50.29,99.82 | R4.1 v59.82,95.12 | C8.2 v58.17,89.79 | R28.1 v44.96,82.42 | R2.2 67.58,42.66 v67.56,42.67 | R34.1 12.94,62.49 v12.95,62.48 | R12.1 v90.3,42.42 | R50.1 94.73,52.57 v94.74,52.58 | R48.1 94.73,46.6 v94.74,46.61 | v157.23,50.93 157.22,50.94 R77.1 157.23,52.34 157.23,53.21 157.73,53.72 C24.2 | SW1.P$1 v165.86,48.01 | R58.1 v159.77,61.47 | C15.1 v120.78,99.19 | R51.2 v133.48,99.19 | R6.1 v141.6,90.81 | D1.A v143.76,85.09 | R46.1 v121.28,82.17 | U5.P$5 124.85,89.55 v124.21,88.9 | U5.P$12 127.11,91.68 v127.64,92.2 | C18.2 v130.56,80.64 | R57.1 R56.1 128.03,64.27 v128.02,64.26 | U7.P$3 135.51,52.07 135.76,52.32 v135.76,54.23 | C25.1 v181.36,50.04 | C3.2 38.73,93.09 38.48,92.84 36.45,92.84 v33.4,95.89 | C6.2 43.81,96.52 v42.8,97.54 | C17.1 v117.6,99.19 | R44.1 v123.95,99.19 | R21.1 v68.96,61.72 | R30.2 61.23,67.7 v61.21,67.69 | R26.2 67.68,51.19 v67.69,51.18 | C23.2 180.33,45.73 v180.34,45.72 | U2.P$2 56.5,22.97 v56.9,23.37 | R10.1 v59.05,25.65 | U3.P$1 95,40.64 | U3.P$2 94,39.23 v93.47,39.75
  Top 0.813: R24.P$1 14.66,26.99 15.75,25.91 | 15.75,25.91 v15.75,24 | R3.P$1 16.83,26.99 15.75,25.91 | 166.99,42.2 M1.P$1 166.99,39.39 v167.77,38.61 | 95,40.64 95,42.55 98.42,45.97 103.76,45.97 104.65,46.86 104.65,62.04 R19.P$1
  Bottom 1.27: v67.18,59.69 67.18,59.82
  other vias: 179.32,54.36 108.08,55.5 65.79,46.86
  pour Top (no thermals): 181.1,59.56 177.67,59.56 176.78,58.67 176.78,52.83 177.67,51.94 181.1,51.94 181.86,52.83 181.86,58.67
  pour Bottom: 0.13,115.06 188.85,115.06 188.72,0 0,0
  pour Top (no thermals): 100.08,63.63 100.08,57.15 105.16,52.07 111,52.07 111.89,52.96 111.89,58.17 109.98,60.07 108.08,60.07 107.44,60.83 107.44,63.88 106.81,64.52 100.97,64.52
  pour Top (no thermals): 64.52,44.96 62.99,44.96 arc-90 62.87,45.09 62.87,45.47 62.87,45.72 arc-90 63.25,46.1 63.88,46.1 arc90 64.64,46.86 arc-90 65.79,48.01 65.91,48.01 arc-90 66.93,46.99 66.93,46.86 66.93,46.23 arc-90 65.66,44.96
  pour Top (no thermals): 67.56,58.42 arc90 68.45,59.44 68.45,60.07 arc59 67.82,60.96 67.31,61.21 arc40 65.66,61.59 64.14,61.59 arc90 64.01,61.47 64.01,61.21 arc90 66.8,58.42
L1_REF
  Top 0.406: R33.1 R34.2 19.43,64.14 V44.P$1
L1_SNS
  Top 0.406: U2.P$5 55.2,15.54 56.13,14.61 61.09,14.61 62.48,16 V43.P$1
L1_SNS1
  Top 0.406: U3.P$5 99.21,27.32 V13.P$1
LF1_REF
  Top 0.406: V58.P$1 86.24,54.37 R50.2 96.62,54.37 R49.2
LF2_REF
  Top 0.406: V59.P$1 86.24,48.4 R48.2 96.62,48.4 R47.1
LF_B1_BT
  Top 0.406: V32.P$1 133.73,66.8 135.38,65.15 135.38,62.87 135,62.48 133.74,62.48 R57.2 133.73,53.59 133.99,53.34 U7.P$4
LF_B1_OSNS  (via drill 0.35)
  Top 0.305: R79.1 161.28,55.89 v161.29,55.88
  Top 0.406: C24.1 161.04,57.67 R79.1
  Bottom 0.305: v161.29,55.88 161.29,49.53 164.72,46.1 172.09,46.1 177.16,41.02 177.16,33.66 178.94,31.88 V31.P$1
LF_B1_OUTEN  (via drill 0.41 pad 0.81)  (1 unrouted)
  Top 0.305: M1.P$4 168.03,42.91 168.28,42.67 168.28,40.64 v168.4,40.51 | R78.1 162.95,47.74 167,43.69 167,42.93 M1.P$4
  Bottom 0.305: v168.4,40.51 171.07,37.85 171.07,29.34
  Bottom 0.406: 171.07,29.34 177.42,22.99 V20.P$1
LF_B1_TT
  Top 0.406: V29.P$1 128.14,67.56 126.87,66.29 126.87,64.01 128.41,62.47 R56.2 129.92,61.21 131.06,60.07 131.06,53.47 133.73,50.8 U7.P$2
LFPO_IN  (via drill 0.41 pad 0.81)
  Top 0.203: U5.P$3
  Top 0.406: U5.P$3 122.81,90.68 122.3,90.17 118.17,90.17 v117.6,90.74 | 111.51,101.28 111.51,99.19 115.07,95.62 C17.2 v117.6,94.23 | 111.51,101.28 V9.P$1 | V75.P$1 111.44,101.35 111.51,101.28 | v117.6,87.12 117.6,86.12 R45.2
  Bottom 0.406: v117.6,94.23 v117.6,90.74 v117.6,87.12
LFPOBAT  (via drill 0.41 pad 0.81)
  Top 0.406: R49.1 98.44,59.17 V63.P$1 | U5.P$9 127.24,90.18 129.03,88.39 R53.2 130.67,86.62 | 130.67,86.62 132.21,85.09 D1.C 136.39,76.6 LIFEPO1.PLUS 133.06,76.54 125.6,69.09 125.6,60.96 127,59.56 128.72,59.56 R54.P$2 | 130.67,86.62 130.67,84.2 C18.1 130.54,84.07 129.54,84.07 128.4,82.93 v123.83,82.93
  Bottom 0.406: V63.P$1 99.44,75.69 99.44,79.88 102.49,82.93 v123.83,82.93
  pour Top (no thermals): 135.13,79.88 139.06,79.88 141.73,82.42 172.47,82.55 178.18,76.2 178.31,72.14 134.87,72.14 133.22,74.3 133.22,77.85 133.86,78.74
LFPOBOOST
  Top 0.203: 120.08,91.2 C16.2 | 120.08,91.2 124.29,91.2 U5.P$2 | 120.08,91.2 118.82,92.46 91.06,92.46 88.39,95.12
  Top 0.254: V54.P$1 88.39,95.12
LFPOCHGSNS  (via drill 0.41 pad 0.81)
  Top 0.203: U5.P$8 126.36,89.62 126.36,88.39 127.89,86.87 127.89,85.63 L3.P$1 129.54,85.6 v129.79,85.34
  Bottom 0.203: V61.P$1 90.17,98.93 93.22,98.93 106.43,85.72 120.9,85.72 122.68,83.95 129.41,83.95 129.79,84.33 v129.79,85.34
LFPOFB  (via drill 0.41 pad 0.81)
  Top 0.203: U5.P$10 131.7,90.68 132.47,91.45 R52.2 R53.1 v132.46,85.98 | v100.2,82.42 100.97,82.42 102.23,83.82 106.93,83.82 109.86,80.9 128.14,80.9 v128.27,81.03
  Bottom 0.203: V70.P$1 v100.2,82.42 | v128.27,81.03 129.92,81.03 132.46,83.57 v132.46,85.98
LFPOFREQ  (via drill 0.35, 0.41 pad 0.81)
  Top 0.203: R6.2 134.11,90.81 v133.22,89.92 | v126.01,87.81 126.01,88.62 125.86,88.77 U5.P$7 | v100.84,95.12 V62.P$1
  Top 0.406: R7.1 R6.2
  Bottom 0.203: v133.22,89.92 129.54,89.92 127.76,88.14 127.38,87.76 126.07,87.76 v126.01,87.81 120.62,87.81 119.27,86.46 117.33,86.46 117.3,86.49 109.47,86.49 v100.84,95.12
LFPOINTVCC  (via drill 0.41 pad 0.81)
  Top 0.203: C15.2 120.78,94.49 | U5.P$1 124.29,91.69 122.81,91.69 122.17,92.33 v122.17,92.46 122.17,93.09 120.78,94.49 | V69.P$1 100.84,101.47 108.97,93.34 119.63,93.34 120.78,94.49 | v139.06,93.73 139.06,95.49 R7.2
  Bottom 0.203: v122.17,92.46 126.24,92.46 126.87,93.09 138.43,93.09 v139.06,93.73
LFPOMPPT  (via drill 0.41 pad 0.81)
  Top 0.203: R46.2 121.02,85.85 R45.1 119.14,84.97 v117.86,83.69 | R46.2 121.78,85.86 | U5.P$6 125.35,88.9 125.35,84.71 124.71,84.07 123.19,84.07 122.56,84.71 122.56,85.34 122.04,85.86 R46.2
  Bottom 0.203: v117.86,83.69 98.93,83.69 V60.P$1
LFPOPROG
  Top 0.203: R51.1 132.12,95.62 132.07,95.62 129.41,92.96 126.49,92.96 126.36,92.84 126.36,92.24 U5.P$13 | V65.P$1 122.68,107.82 132.08,98.42 132.08,95.66
  Top 0.254: 132.08,95.66 132.12,95.62
LFPORUN
  Top 0.203: 123.95,95.6 R44.2 122.81,95.63 122.05,96.39 122.05,99.31 121.54,99.82 120.14,99.82 115.57,104.39 90.93,104.39 V68.P$1 | 123.95,95.6 123.95,93.85 124.84,92.96 124.84,92.24 U5.P$16 | 123.98,95.63 123.95,95.6
LFPOSNS+  (via drill 0.81 pad 1.63)
  Top 0.305: U3.P$8 99.21,39.99 99.19,40.01
  Top 0.813: 99.19,40.01 v99.19,42.42 | v99.57,64.9 99.69,64.9 101.47,66.67 103.32,66.67 R19.P$2
  Bottom 0.813: v99.19,42.42 99.19,44.45 100.71,45.97 100.71,62.61 99.57,63.75 v99.57,64.9
  pour Top (no thermals): 100.84,65.41 106.81,65.41 107.44,65.91 107.44,69.6 111.76,73.53 111.76,79.12 110.87,80.01 102.11,80.01 100.33,78.23 100.33,65.91
LFPOSW
  Top 0.203: U5.P$4 123.7,90.17 122.92,89.4 | C16.1 120.04,89.4 122.92,89.4 | V57.P$1 90.55,88.77 92.71,86.61 114.68,86.61 117.35,89.28 119.92,89.28 | 122.92,89.4 122.95,89.4 123.32,89.03 123.32,87.25 123.83,86.74 123.83,85.63 L3.P$2
  Top 0.254: 119.92,89.28 120.04,89.4
LIFE2  (via drill 0.41 pad 0.81)
  Top 0.406: R55.P$1 133.35,44.52 133.35,45.97 133.1,46.23 128.14,46.23 125.86,48.51 v124.21,48.51 | U7.P$1 134.6,44.68 134.37,44.45 R55.P$1 | R55.P$1 133.28,34.09 V16.P$1 | R47.2 v102.87,48.39
  Bottom 0.406: LIFEPO2.PLUS 131.7,15.97 V16.P$1 | v102.87,48.39 124.08,48.39 v124.21,48.51
  pour Top (no thermals): 124.71,15.88 157.86,15.88 159.13,14.73 159.26,8.13 158.12,6.73 124.59,6.73 123.7,8 123.7,14.86
LION_IN
  Top 0.203: 40.39,90.82 40.39,95 39.75,95.63 38.87,95.63 C3.1 | 40.39,90.82 40.39,85.86 R27.2 | U1.P$3 45.72,90.94 44.96,90.17 41.03,90.17 40.39,90.82
  Top 0.406: 38.73,96.77 C3.1 | 38.73,96.77 40.64,98.68 44.33,98.68 R15.1 | V35.P$1 V34.P$1 38.73,96.77
LIONBAT  (via drill 0.41 pad 0.81, 0.81 pad 1.63)
  Top 0.203: U1.P$10 52.32,90.94 v52.58,90.68 | U1.P$9 51.42,90.44 52.07,89.79 C8.1
  Top 0.406: F1.1 12.95,59.17 R33.2 12.19,60.45 11.81,60.83 11.81,68.45 V48.P$1 | 55.38,42.42 R1.2 | 54.47,81.81 54.59,81.81
  Top 0.813: C8.1 54.47,81.81 54.47,78.99 51.77,76.29 LI-ION.PLUS | R1.2 52.21,42.41 v49.66,44.96 | v35.05,59.44 30.23,64.26 | R20.2 36.31,66.18 31.24,71.25
  Bottom 0.203: v52.58,90.68 52.58,86.61 46.35,80.39 33.4,80.39 29.3,76.29 LI-ION.PLUS
  Bottom 0.813: v49.66,44.96 49.53,44.96 v35.05,59.44
  pour Top (no thermals): 28.19,53.72 11.18,53.72 10.67,54.1 10.67,57.91 11.18,58.42 23.24,58.42 26.04,61.34 26.04,78.74 26.92,79.63 31.75,79.63 32.51,78.87 32.51,57.91
LIONBOOST  (via drill 0.41 pad 0.81)
  Top 0.203: U1.P$2 45.34,91.44 44.83,90.93 43.83,90.93 C4.1 v41.91,90.93 | V36.P$1 14.86,95.25 19.18,90.93 v38.1,90.93
  Bottom 0.203: v38.1,90.93 v41.91,90.93
LIONCHGSNS  (via drill 0.41 pad 0.81)
  Top 0.203: U1.P$8 50.15,87.52 51.44,86.23 51.44,84.87 L1.P$2 51.44,84.8 51.44,83.44 49.4,81.41 v37.97,81.41
  Bottom 0.203: V46.P$1 17.4,101.47 19.43,99.44 21.72,99.44 27.3,93.85 27.3,88.01 33.91,81.41 v37.97,81.41
LIONFREQ  (via drill 0.41 pad 0.81)
  Top 0.203: R4.2 55.75,95.11 v55.75,93.6 | V47.P$1 20.83,93.98 22.99,91.82 v30.99,91.82 | U1.P$7 49.65,88.39 v49.28,88.01
  Top 0.406: R5.1 R4.2
  Bottom 0.203: v30.99,91.82 43.56,91.82 47.37,88.01 v49.28,88.01 50.04,88.01 50.93,88.9 50.93,90.17 52.83,92.08 54.23,92.08 v55.75,93.6
LIONINTVCC  (via drill 0.41 pad 0.81)
  Top 0.203: U1.P$1 47.37,91.95 v46.61,92.71 45.22,94.1 C6.1 v41.66,94.11 | v57.53,97.92 57.53,99.56 R5.2
  Bottom 0.203: V55.P$1 23.5,101.47 30.86,94.11 v41.66,94.11 | v46.61,92.71 51.44,92.71 56.64,97.92 v57.53,97.92
LIONMPPT
  Top 0.203: R28.2 45.09,85.87 | R28.2 42.29,85.74 R27.1 42.16,84.45 41.02,83.31 38.61,83.31 33.15,88.77 V39.P$1 | R28.2 44.97,85.72 45.97,85.72 46.23,85.47 46.23,83.69 46.61,83.31 48.13,83.31 48.39,83.57 48.39,88.65 49.15,89.41 U1.P$6
LIONPROG
  Top 0.203: U1.P$13 50.16,92.5 50.16,92.96 51.18,93.98 51.18,95.38 52.08,96.28 R25.2 52.07,99.31 43.56,107.82 V50.P$1
LIONRUN  (via drill 0.41 pad 0.81)
  Top 0.203: U1.P$16 48.64,93.34 47.89,94.1 R15.2 47.12,94.74 46.86,95 v45.47,95
  Bottom 0.203: V53.P$1 17.4,104.9 38.86,104.9 43.81,99.95 43.81,96.65 v45.47,95
LIONSNS+
  Top 0.406: R8.P$2 53.53,17.72 54.23,18.41 57.02,18.41 57.15,18.29 U2.P$8
  Top 1.27: R8.P$2 50.29,12.92 LI-ION.MINUS
LIONSW  (via drill 0.41 pad 0.81)
  Top 0.203: C4.2 43.81,87.5 44.32,87 46.23,87 47.37,85.85 47.37,84.87 L1.P$1 | U1.P$4 47.51,90.44 46.23,89.15 43.83,89.15 C4.2 | V38.P$1 17.91,88.77 19.56,90.42 36.83,90.42 v38.1,89.15 | v41.91,89.15 43.8,89.15 C4.2
  Bottom 0.203: v38.1,89.15 v41.91,89.15
LPFOFBG
  Top 0.203: R52.1 128.91,92.33 127.76,91.19 U5.P$11
N$1
  Top 0.406: R2.1 69.3,44.5 U6.VM
N$2
  Top 0.406: V11.P$1 90.29,27.32 R11.2 90.29,38.59 R12.2 94.98,38.6 U3.P$3 96.87,38.58 97.54,39.24 99.19,39.24 U3.P$7
N$3
  pour Top (no thermals): 10.16,47.75 10.16,47.62 arc90 12.83,44.96 24.51,44.96 arc90 27.18,47.62 27.18,51.69 27.18,52.07 arc90 26.16,53.09 11.94,53.09 arc90 10.16,51.31
N$4  (via drill 0.41 pad 0.81)
  Top 0.406: U6.VSS 58.24,44.5 v57.66,45.09 | v59.69,49.4 61.46,49.4 R29.2 R26.1
  Bottom 0.406: v57.66,45.09 57.66,47.37 v59.69,49.4
N$5
  Top 0.406: 55.34,44.23 R1.1 55.38,44.2 56.26,44.2 56.55,43.9 U6.VDD
  Top 0.813: R1.1 C1.1
N$6
  Top 0.305: V21.P$1 V26.P$1
  pour Top (no thermals): 170.43,52.07 175.77,52.07 176.28,51.56 176.28,40.51 175.64,38.35 169.8,38.35 169.8,51.31
  pour Top (no thermals): 158.62,30.23 168.53,30.23 169.8,31.75 169.8,40.64 176.28,40.64 176.4,28.83 167.39,19.94 158.62,19.94
  pour Top (no thermals): 176.53,35.69 176.4,45.34 177.29,44.58 183.9,44.58 184.78,43.69 184.78,37.21 183.9,36.32 177.16,36.32
N$7
  Top 0.305: M1.P$5 M1.P$6 M1.P$7 M1.P$8
  Top 0.813: M1.P$5 164.19,41.27 | 164.19,41.27 164.19,39.4 164.85,38.73 M2.1 | M1.P$5 161.57,42.91 R23.1 | M1.P$5 164.84,42.91 M1.PAD | 164.19,41.27 164.7,41.27 M1.PAD | M1.P$7 165.34,41.91 M1.PAD | M1.P$6 165.34,42.41 M1.PAD
N$8
  Top 0.406: R20.1 C2.1 59.32,61.86 59.56,62.1 60.44,62.1 U4.P$5
N$9  (via drill 0.41 pad 0.81)
  Top 0.406: 61.46,51.18 R29.1 | U4.P$3 64.26,62.76 64.26,63.37 63.37,64.26 v63.37,64.39 63.5,64.39 64.52,65.41 64.52,68.44 64.12,68.83 60.31,68.83 R31.2 | 59.45,60.08 59.45,60.06 60.2,59.31 v61.47,59.31 | R8.P$1 54.17,21.14 54.74,20.57 57.02,20.57 57.15,20.7 U2.P$1
  Top 0.813: R24.P$2 R3.P$2 | 55.38,50.42 C1.2 | 56.77,50.31 56.65,50.43
  Top 1.27: 47.37,47.75 50.04,50.42 55.36,50.42 C1.2 56.65,50.43 57.4,51.18 61.46,51.18 | 47.37,47.75 47.24,57.4 49.91,60.07 54.73,60.07 C2.2 59.42,60.06 59.45,60.08 | 47.37,24.06 R8.P$1 | 47.37,47.75 47.37,24.06 | R3.P$2 41.02,30.41 47.37,24.06
  Bottom 0.406: v61.47,59.31 61.59,59.31 62.36,60.07 62.36,63.37 v63.37,64.39
  pour Top (no thermals): 56.01,49.91 56.13,49.91 arc-90 56.77,49.15 56.77,47.62 arc53 57.02,47.12 59.05,45.09 arc53 59.44,44.96 60.45,44.96 arc90 60.58,45.09 60.58,46.23 58.67,48.13 arc-53 58.42,48.9 arc120 56.01,50.8
  pour Top (no thermals): 58.55,60.58 58.8,60.58 arc90 59.44,60.83 59.44,61.09 arc-90 59.94,61.59 60.58,61.59 arc-90 60.71,61.47 60.71,60.71 arc-90 59.56,59.56 arc-90
N$10
  Top 0.406: U4.P$4 60.45,63.5 59.18,64.77 R31.1 R30.1
N$11
  Top 0.305: 55.88,23.5 55.88,24.1 55.87,24.11
  Top 0.406: 55.87,24.64 R10.2 R9.2 | 55.87,24.64 55.87,24.11 55.87,21.61 U2.P$3 | 55.87,23.5 55.88,23.5 | U2.P$7 56.52,17.36 56.52,16.64 56.64,16.51 57.91,16.51 58.42,17.02 58.42,21.97 57.66,22.73 57.66,23.88 | 55.87,24.64 56.01,24.64 56.39,24.26 57.28,24.26 57.66,23.88 | 57.66,23.88 64.26,23.88 V12.P$1
N$14
  Top 0.406: R21.2 68.94,65.14 68.93,65.15 67.69,65.15 64.63,62.09 U4.P$2
N$24
  Top 0.406: U7.P$8 U7.P$7 127.89,50.8 127.38,51.31 127.38,53.59 128.78,54.99 R54.P$1
N$25  (via drill 0.35)
  Top 0.406: U7.P$5 U7.P$6 129.79,52.07 v130.56,51.31 | v128.14,44.96 128.14,44.7 128.4,44.45 R55.P$2
  Bottom 0.406: v130.56,51.31 130.56,47.88 128.14,45.47 v128.14,44.96
N$68  (via drill 0.35)
  Top 0.406: R77.2 159.01,49.55 R78.2 162.19,49.54 165.1,52.45 166.62,52.45 167.13,51.94 SW1.P$2 167.13,48.26 167.51,47.88 v167.89,47.88 | C25.2 178.04,49.14 v176.78,47.88
  Bottom 0.406: v176.78,47.88 v167.89,47.88
N$686
  Top 0.406: R58.2 R79.2 163.08,57.27 168.4,51.94 SW1.P$3

### Text on the board
tValues: LifePo charger / in | Li-ion charger / in | FREQ program / resistors | INTVCC (1.5MHz) | FREQ program / resistors | INTVCC (1.5MHz) | GND (750KHz) | Brown Space Eng. / EQUiSat Aug. 17 / Battery Test Board V1 | GND (750KHz) | Li-ion inputs | LifePo inputs | Solder only one of F5, / F4, or R14 & R16 | Only solder one of / U4, U6 or the two / bypass resistors | Li-ion outputs | voltage | LifePo outputs | GND | Only solder / F1 or / R13 & R12 | GND | Li-ion out | LifePo out | Li-ion current sense | Ref | Out | Protection Bypass | LifePo current sense | Out | Ref | Solder only one / of M2 or SW1 | AD8418 | LIFEPO